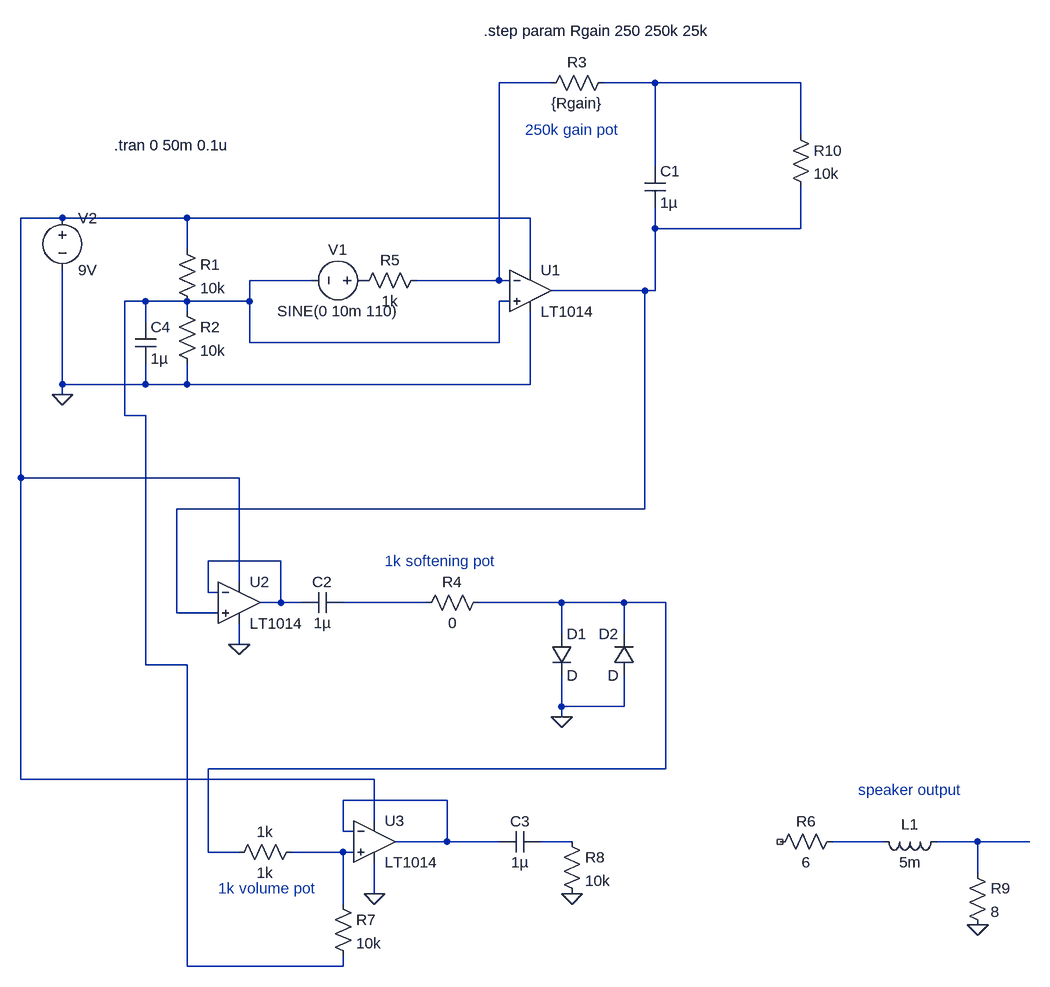
[diagram p0: schematic voicedistorterpedal.asc]
voicedistorterpedal.asc, the LTspice schematic file:
Version 4.1
SHEET 1 1836 1284
WIRE 416 -192 336 -192
WIRE 576 -192 496 -192
WIRE 800 -192 576 -192
WIRE 800 -112 800 -192
WIRE 576 -64 576 -192
WIRE -336 16 -400 16
WIRE -144 16 -336 16
WIRE 384 16 -144 16
WIRE 576 32 576 0
WIRE 800 32 800 -32
WIRE 800 32 576 32
WIRE -144 64 -144 16
WIRE 384 96 384 16
WIRE 48 112 -48 112
WIRE 336 112 336 -192
WIRE 336 112 208 112
WIRE 352 112 336 112
WIRE 560 128 416 128
WIRE 576 128 576 32
WIRE 576 128 560 128
WIRE -208 144 -240 144
WIRE -144 144 -208 144
WIRE -48 144 -48 112
WIRE -48 144 -144 144
WIRE 352 144 336 144
WIRE -144 160 -144 144
WIRE -208 176 -208 144
WIRE -48 208 -48 144
WIRE 336 208 336 144
WIRE 336 208 -48 208
WIRE -336 272 -336 96
WIRE -208 272 -208 240
WIRE -208 272 -336 272
WIRE -144 272 -144 240
WIRE -144 272 -208 272
WIRE 384 272 384 160
WIRE 384 272 -144 272
WIRE -336 288 -336 272
WIRE -240 320 -240 144
WIRE -208 320 -240 320
WIRE -400 416 -400 16
WIRE -64 416 -400 416
WIRE 560 464 560 128
WIRE 560 464 -160 464
WIRE 0 544 -112 544
WIRE -64 576 -64 416
WIRE -112 592 -112 544
WIRE -96 592 -112 592
WIRE 0 608 0 544
WIRE 0 608 -32 608
WIRE 32 608 0 608
WIRE 224 608 96 608
WIRE 432 608 304 608
WIRE 528 608 432 608
WIRE 592 608 528 608
WIRE -160 624 -160 464
WIRE -96 624 -160 624
WIRE 432 656 432 608
WIRE 528 656 528 608
WIRE -64 672 -64 640
WIRE -208 704 -208 320
WIRE -144 704 -208 704
WIRE 432 768 432 720
WIRE 528 768 528 720
WIRE 528 768 432 768
WIRE 432 784 432 768
WIRE 592 864 592 608
WIRE 592 864 -112 864
WIRE -400 880 -400 416
WIRE 144 880 -400 880
WIRE 256 912 96 912
WIRE 144 944 144 880
WIRE 96 960 96 912
WIRE 112 960 96 960
WIRE 256 976 256 912
WIRE 256 976 176 976
WIRE 336 976 256 976
WIRE 448 976 400 976
WIRE 928 976 848 976
WIRE 1072 976 1008 976
WIRE 1152 976 1072 976
WIRE -112 992 -112 864
WIRE -64 992 -112 992
WIRE 96 992 16 992
WIRE 112 992 96 992
WIRE 1072 1024 1072 976
WIRE 144 1056 144 1008
WIRE 96 1072 96 992
WIRE -144 1168 -144 704
WIRE 96 1168 96 1152
WIRE 96 1168 -144 1168
FLAG -336 288 0
FLAG 432 784 0
FLAG -64 672 0
FLAG 144 1056 0
FLAG 448 1056 0
FLAG 1072 1104 0
SYMBOL voltage 144 112 R90
WINDOW 0 -32 56 VBottom 2
WINDOW 3 32 56 VTop 2
WINDOW 123 0 0 Left 0
WINDOW 39 0 0 Left 0
SYMATTR InstName V1
SYMATTR Value SINE(0 10m 110)
SYMBOL OpAmps\\LT1014 384 64 R0
SYMATTR InstName U1
SYMBOL voltage -336 0 R0
WINDOW 123 0 0 Left 0
WINDOW 39 0 0 Left 0
SYMATTR InstName V2
SYMATTR Value 9V
SYMBOL res -160 48 R0
SYMATTR InstName R1
SYMATTR Value 10k
SYMBOL res -160 144 R0
SYMATTR InstName R2
SYMATTR Value 10k
SYMBOL res 224 96 R90
WINDOW 0 0 56 VBottom 2
WINDOW 3 32 56 VTop 2
SYMATTR InstName R5
SYMATTR Value 1k
SYMBOL cap 560 -64 R0
SYMATTR InstName C1
SYMATTR Value 1µ
SYMBOL cap -224 176 R0
SYMATTR InstName C4
SYMATTR Value 1µ
SYMBOL res 784 -128 R0
SYMATTR InstName R10
SYMATTR Value 10k
SYMBOL cap 96 592 R90
WINDOW 0 0 32 VBottom 2
WINDOW 3 32 32 VTop 2
SYMATTR InstName C2
SYMATTR Value 1µ
SYMBOL diode 416 656 R0
SYMATTR InstName D1
SYMBOL diode 544 720 R180
WINDOW 0 24 64 Left 2
WINDOW 3 24 0 Left 2
SYMATTR InstName D2
SYMBOL OpAmps\\LT1014 -64 544 R0
SYMATTR InstName U2
SYMBOL res 320 592 R90
WINDOW 0 0 56 VBottom 2
WINDOW 3 32 56 VTop 2
SYMATTR InstName R4
SYMATTR Value 0
SYMBOL res 512 -208 R90
WINDOW 0 0 56 VBottom 2
WINDOW 3 32 56 VTop 2
SYMATTR InstName R3
SYMATTR Value {Rgain}
SYMBOL OpAmps\\LT1014 144 912 R0
SYMATTR InstName U3
SYMBOL res 32 976 R90
WINDOW 0 0 56 VBottom 2
WINDOW 3 32 56 VTop 2
SYMATTR InstName 1k
SYMATTR Value 1k
SYMBOL res 80 1056 R0
SYMATTR InstName R7
SYMATTR Value 10k
SYMBOL cap 400 960 R90
WINDOW 0 0 32 VBottom 2
WINDOW 3 32 32 VTop 2
SYMATTR InstName C3
SYMATTR Value 1µ
SYMBOL res 432 960 R0
SYMATTR InstName R8
SYMATTR Value 10k
SYMBOL res 864 960 R90
WINDOW 0 0 56 VBottom 2
WINDOW 3 32 56 VTop 2
SYMATTR InstName R6
SYMATTR Value 6
SYMBOL ind 1024 960 R90
WINDOW 0 5 56 VBottom 2
WINDOW 3 32 56 VTop 2
SYMATTR InstName L1
SYMATTR Value 5m
SYMATTR SpiceLine Rser=1m
SYMBOL res 1056 1008 R0
SYMATTR InstName R9
SYMATTR Value 8
TEXT -256 -96 Left 2 !.tran 0 50m 0.1u
TEXT 160 544 Left 2 ;1k softening pot
TEXT 376 -120 Left 2 ;250k gain pot
TEXT -96 1048 Left 2 ;1k volume pot
TEXT 888 896 Left 2 ;speaker output
TEXT 312 -272 Left 2 !.step param Rgain 250 250k 25k

The netlist it stands for:
* voicedistorterpedal.asc
V1 P001 N005 SINE(0 10m 110)
X§U1 N005 N001 N003 0 N004 LT1014  ; pins In+ In- V+ V- OUT
V2 N003 0 9V
R1 N003 N005 10k
R2 N005 0 10k
R5 N001 P001 1k
C1 N002 N004 1µ
C4 N005 0 1µ
R10 N002 N004 10k
C2 N007 N006 1µ
D1 N008 0 D
D2 0 N008 D
X§U2 N004 N006 N003 0 N006 LT1014  ; pins In+ In- V+ V- OUT
R4 N008 N007 0
R3 N002 N001 {Rgain}
X§U3 N013 N009 N003 0 N009 LT1014  ; pins In+ In- V+ V- OUT
R§1k N013 N008 1k
R7 N013 N005 10k
C3 N010 N009 1µ
R8 N010 0 10k
R6 N011 NC_01 6
L1 N012 N011 5m Rser=1m
R9 N012 0 8
.model D D
.lib standard.dio
.tran 0 50m 0.1u
* 1k softening pot
* 250k gain pot
* 1k volume pot
* speaker output
.step param Rgain 250 250k 25k
.backanno
.end